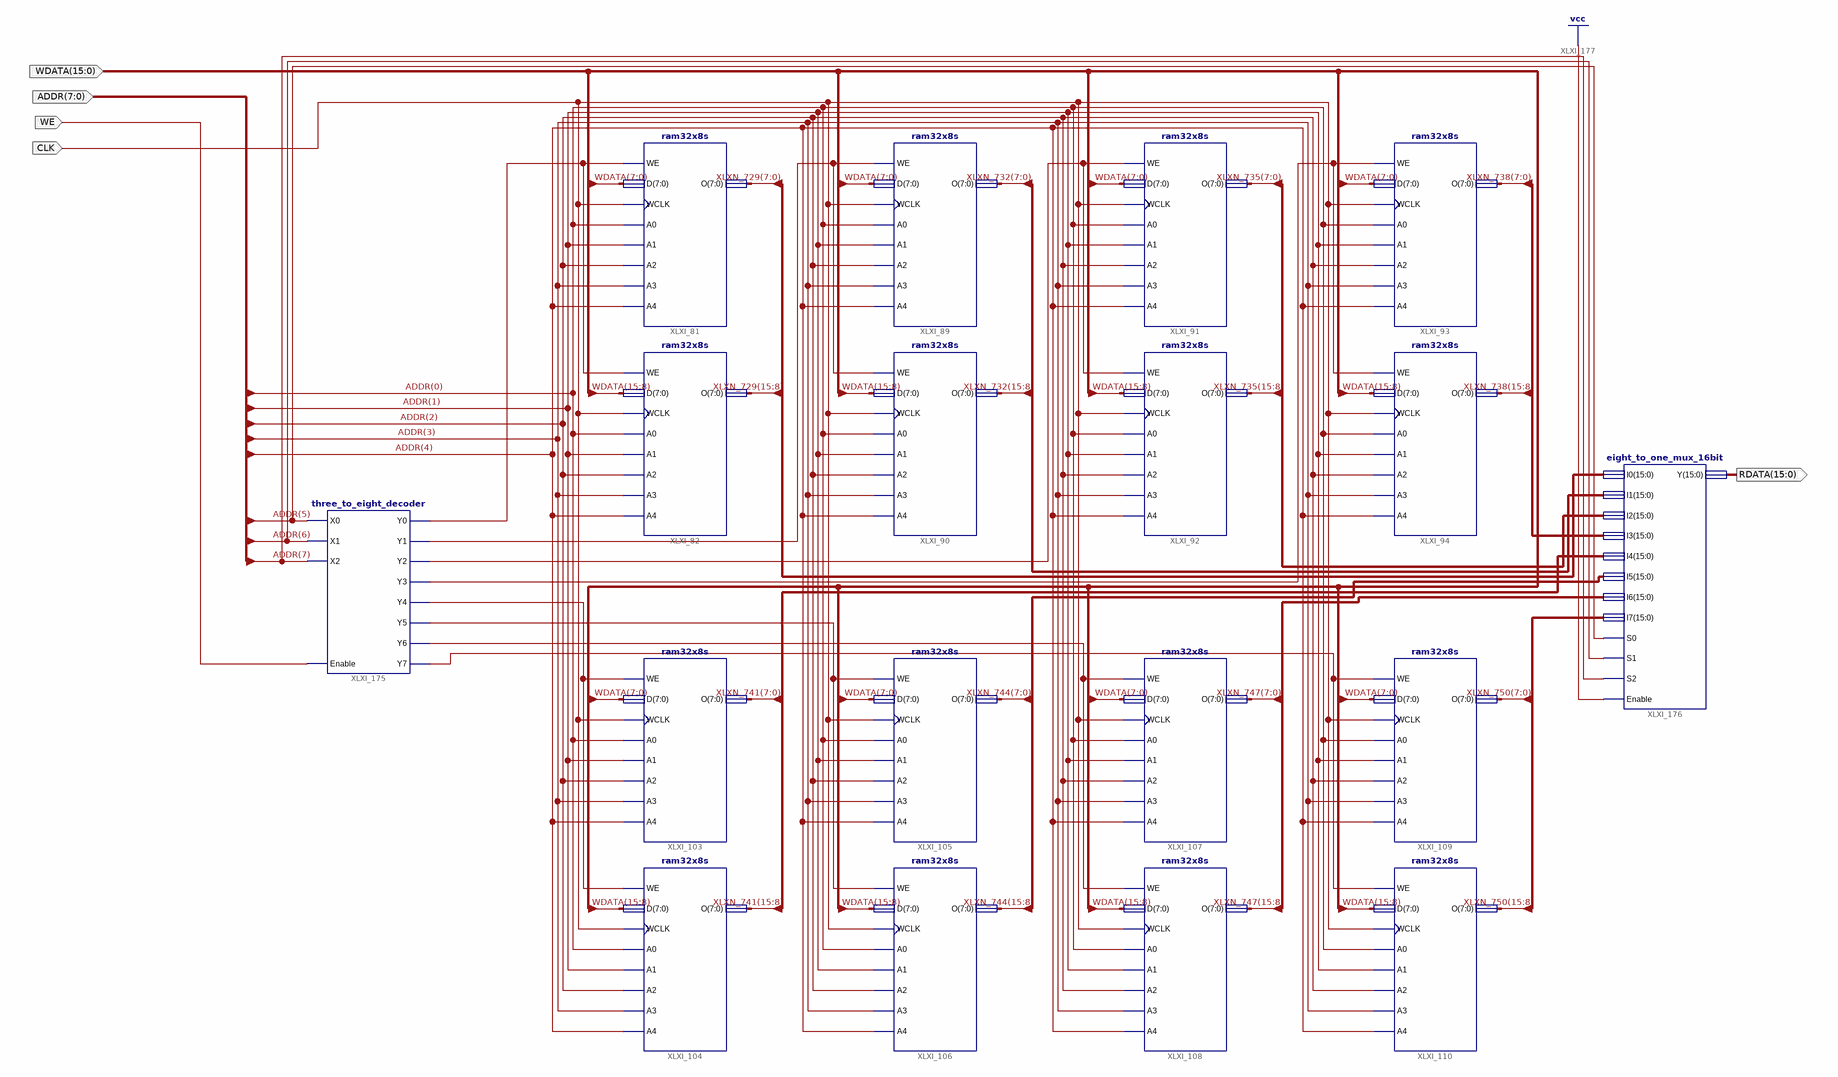
[diagram p0: schematic sheet 1]
// Xilinx ISE schematic mem_256x16.sch (spartan6) as structural Verilog: 18 symbols, 5 ports
module mem_256x16 (
  input  [15:0] WDATA,
  input  [7:0] ADDR,
  input  CLK,
  input  WE,
  output [15:0] RDATA
);

  wire XLXN_298, XLXN_308, XLXN_319, XLXN_718, XLXN_719, XLXN_720, XLXN_721, XLXN_722;
  wire [15:0] XLXN_729, XLXN_732, XLXN_735, XLXN_738, XLXN_741, XLXN_744, XLXN_747, XLXN_750;

  ram32x8s XLXI_81 (
    .A0(ADDR[0]), .A1(ADDR[1]), .A2(ADDR[2]), .A3(ADDR[3]), .A4(ADDR[4]), .D(WDATA[7:0]), .WCLK(CLK),
    .WE(XLXN_718), .O(XLXN_729[7:0]));
  ram32x8s XLXI_82 (
    .A0(ADDR[0]), .A1(ADDR[1]), .A2(ADDR[2]), .A3(ADDR[3]), .A4(ADDR[4]), .D(WDATA[15:8]), .WCLK(CLK),
    .WE(XLXN_718), .O(XLXN_729[15:8]));
  ram32x8s XLXI_91 (
    .A0(ADDR[0]), .A1(ADDR[1]), .A2(ADDR[2]), .A3(ADDR[3]), .A4(ADDR[4]), .D(WDATA[7:0]), .WCLK(CLK),
    .WE(XLXN_720), .O(XLXN_735[7:0]));
  ram32x8s XLXI_93 (
    .A0(ADDR[0]), .A1(ADDR[1]), .A2(ADDR[2]), .A3(ADDR[3]), .A4(ADDR[4]), .D(WDATA[7:0]), .WCLK(CLK),
    .WE(XLXN_721), .O(XLXN_738[7:0]));
  ram32x8s XLXI_94 (
    .A0(ADDR[0]), .A1(ADDR[1]), .A2(ADDR[2]), .A3(ADDR[3]), .A4(ADDR[4]), .D(WDATA[15:8]), .WCLK(CLK),
    .WE(XLXN_721), .O(XLXN_738[15:8]));
  ram32x8s XLXI_92 (
    .A0(ADDR[0]), .A1(ADDR[1]), .A2(ADDR[2]), .A3(ADDR[3]), .A4(ADDR[4]), .D(WDATA[15:8]), .WCLK(CLK),
    .WE(XLXN_720), .O(XLXN_735[15:8]));
  ram32x8s XLXI_103 (
    .A0(ADDR[0]), .A1(ADDR[1]), .A2(ADDR[2]), .A3(ADDR[3]), .A4(ADDR[4]), .D(WDATA[7:0]), .WCLK(CLK),
    .WE(XLXN_298), .O(XLXN_741[7:0]));
  ram32x8s XLXI_104 (
    .A0(ADDR[0]), .A1(ADDR[1]), .A2(ADDR[2]), .A3(ADDR[3]), .A4(ADDR[4]), .D(WDATA[15:8]), .WCLK(CLK),
    .WE(XLXN_298), .O(XLXN_741[15:8]));
  ram32x8s XLXI_106 (
    .A0(ADDR[0]), .A1(ADDR[1]), .A2(ADDR[2]), .A3(ADDR[3]), .A4(ADDR[4]), .D(WDATA[15:8]), .WCLK(CLK),
    .WE(XLXN_308), .O(XLXN_744[15:8]));
  ram32x8s XLXI_107 (
    .A0(ADDR[0]), .A1(ADDR[1]), .A2(ADDR[2]), .A3(ADDR[3]), .A4(ADDR[4]), .D(WDATA[7:0]), .WCLK(CLK),
    .WE(XLXN_319), .O(XLXN_747[7:0]));
  ram32x8s XLXI_108 (
    .A0(ADDR[0]), .A1(ADDR[1]), .A2(ADDR[2]), .A3(ADDR[3]), .A4(ADDR[4]), .D(WDATA[15:8]), .WCLK(CLK),
    .WE(XLXN_319), .O(XLXN_747[15:8]));
  ram32x8s XLXI_109 (
    .A0(ADDR[0]), .A1(ADDR[1]), .A2(ADDR[2]), .A3(ADDR[3]), .A4(ADDR[4]), .D(WDATA[7:0]), .WCLK(CLK),
    .WE(XLXN_722), .O(XLXN_750[7:0]));
  ram32x8s XLXI_110 (
    .A0(ADDR[0]), .A1(ADDR[1]), .A2(ADDR[2]), .A3(ADDR[3]), .A4(ADDR[4]), .D(WDATA[15:8]), .WCLK(CLK),
    .WE(XLXN_722), .O(XLXN_750[15:8]));
  ram32x8s XLXI_90 (
    .A0(ADDR[0]), .A1(ADDR[1]), .A2(ADDR[2]), .A3(ADDR[3]), .A4(ADDR[4]), .D(WDATA[15:8]), .WCLK(CLK),
    .WE(XLXN_719), .O(XLXN_732[15:8]));
  ram32x8s XLXI_89 (
    .A0(ADDR[0]), .A1(ADDR[1]), .A2(ADDR[2]), .A3(ADDR[3]), .A4(ADDR[4]), .D(WDATA[7:0]), .WCLK(CLK),
    .WE(XLXN_719), .O(XLXN_732[7:0]));
  ram32x8s XLXI_105 (
    .A0(ADDR[0]), .A1(ADDR[1]), .A2(ADDR[2]), .A3(ADDR[3]), .A4(ADDR[4]), .D(WDATA[7:0]), .WCLK(CLK),
    .WE(XLXN_308), .O(XLXN_744[7:0]));
  three_to_eight_decoder XLXI_175 (
    .X0(ADDR[5]), .X1(ADDR[6]), .X2(ADDR[7]), .Y0(XLXN_718), .Y1(XLXN_719), .Y2(XLXN_720), .Y3(XLXN_721),
    .Y4(XLXN_298), .Y5(XLXN_308), .Y6(XLXN_319), .Y7(XLXN_722), .Enable(WE));
  eight_to_one_mux_16bit XLXI_176 (
    .Enable(1'b1), .I0(XLXN_729), .I1(XLXN_732), .I2(XLXN_735), .I3(XLXN_738), .I4(XLXN_741), .I5(XLXN_744),
    .I6(XLXN_747), .I7(XLXN_750), .S0(ADDR[5]), .S1(ADDR[6]), .S2(ADDR[7]), .Y(RDATA));
endmodule
